# Altium schematic sheet clouds_v302_0.SchDoc: clouds_v302
size 409 x 282 mm; Date: 3/31/2017 1:28:48 PM; SheetNumber: 1
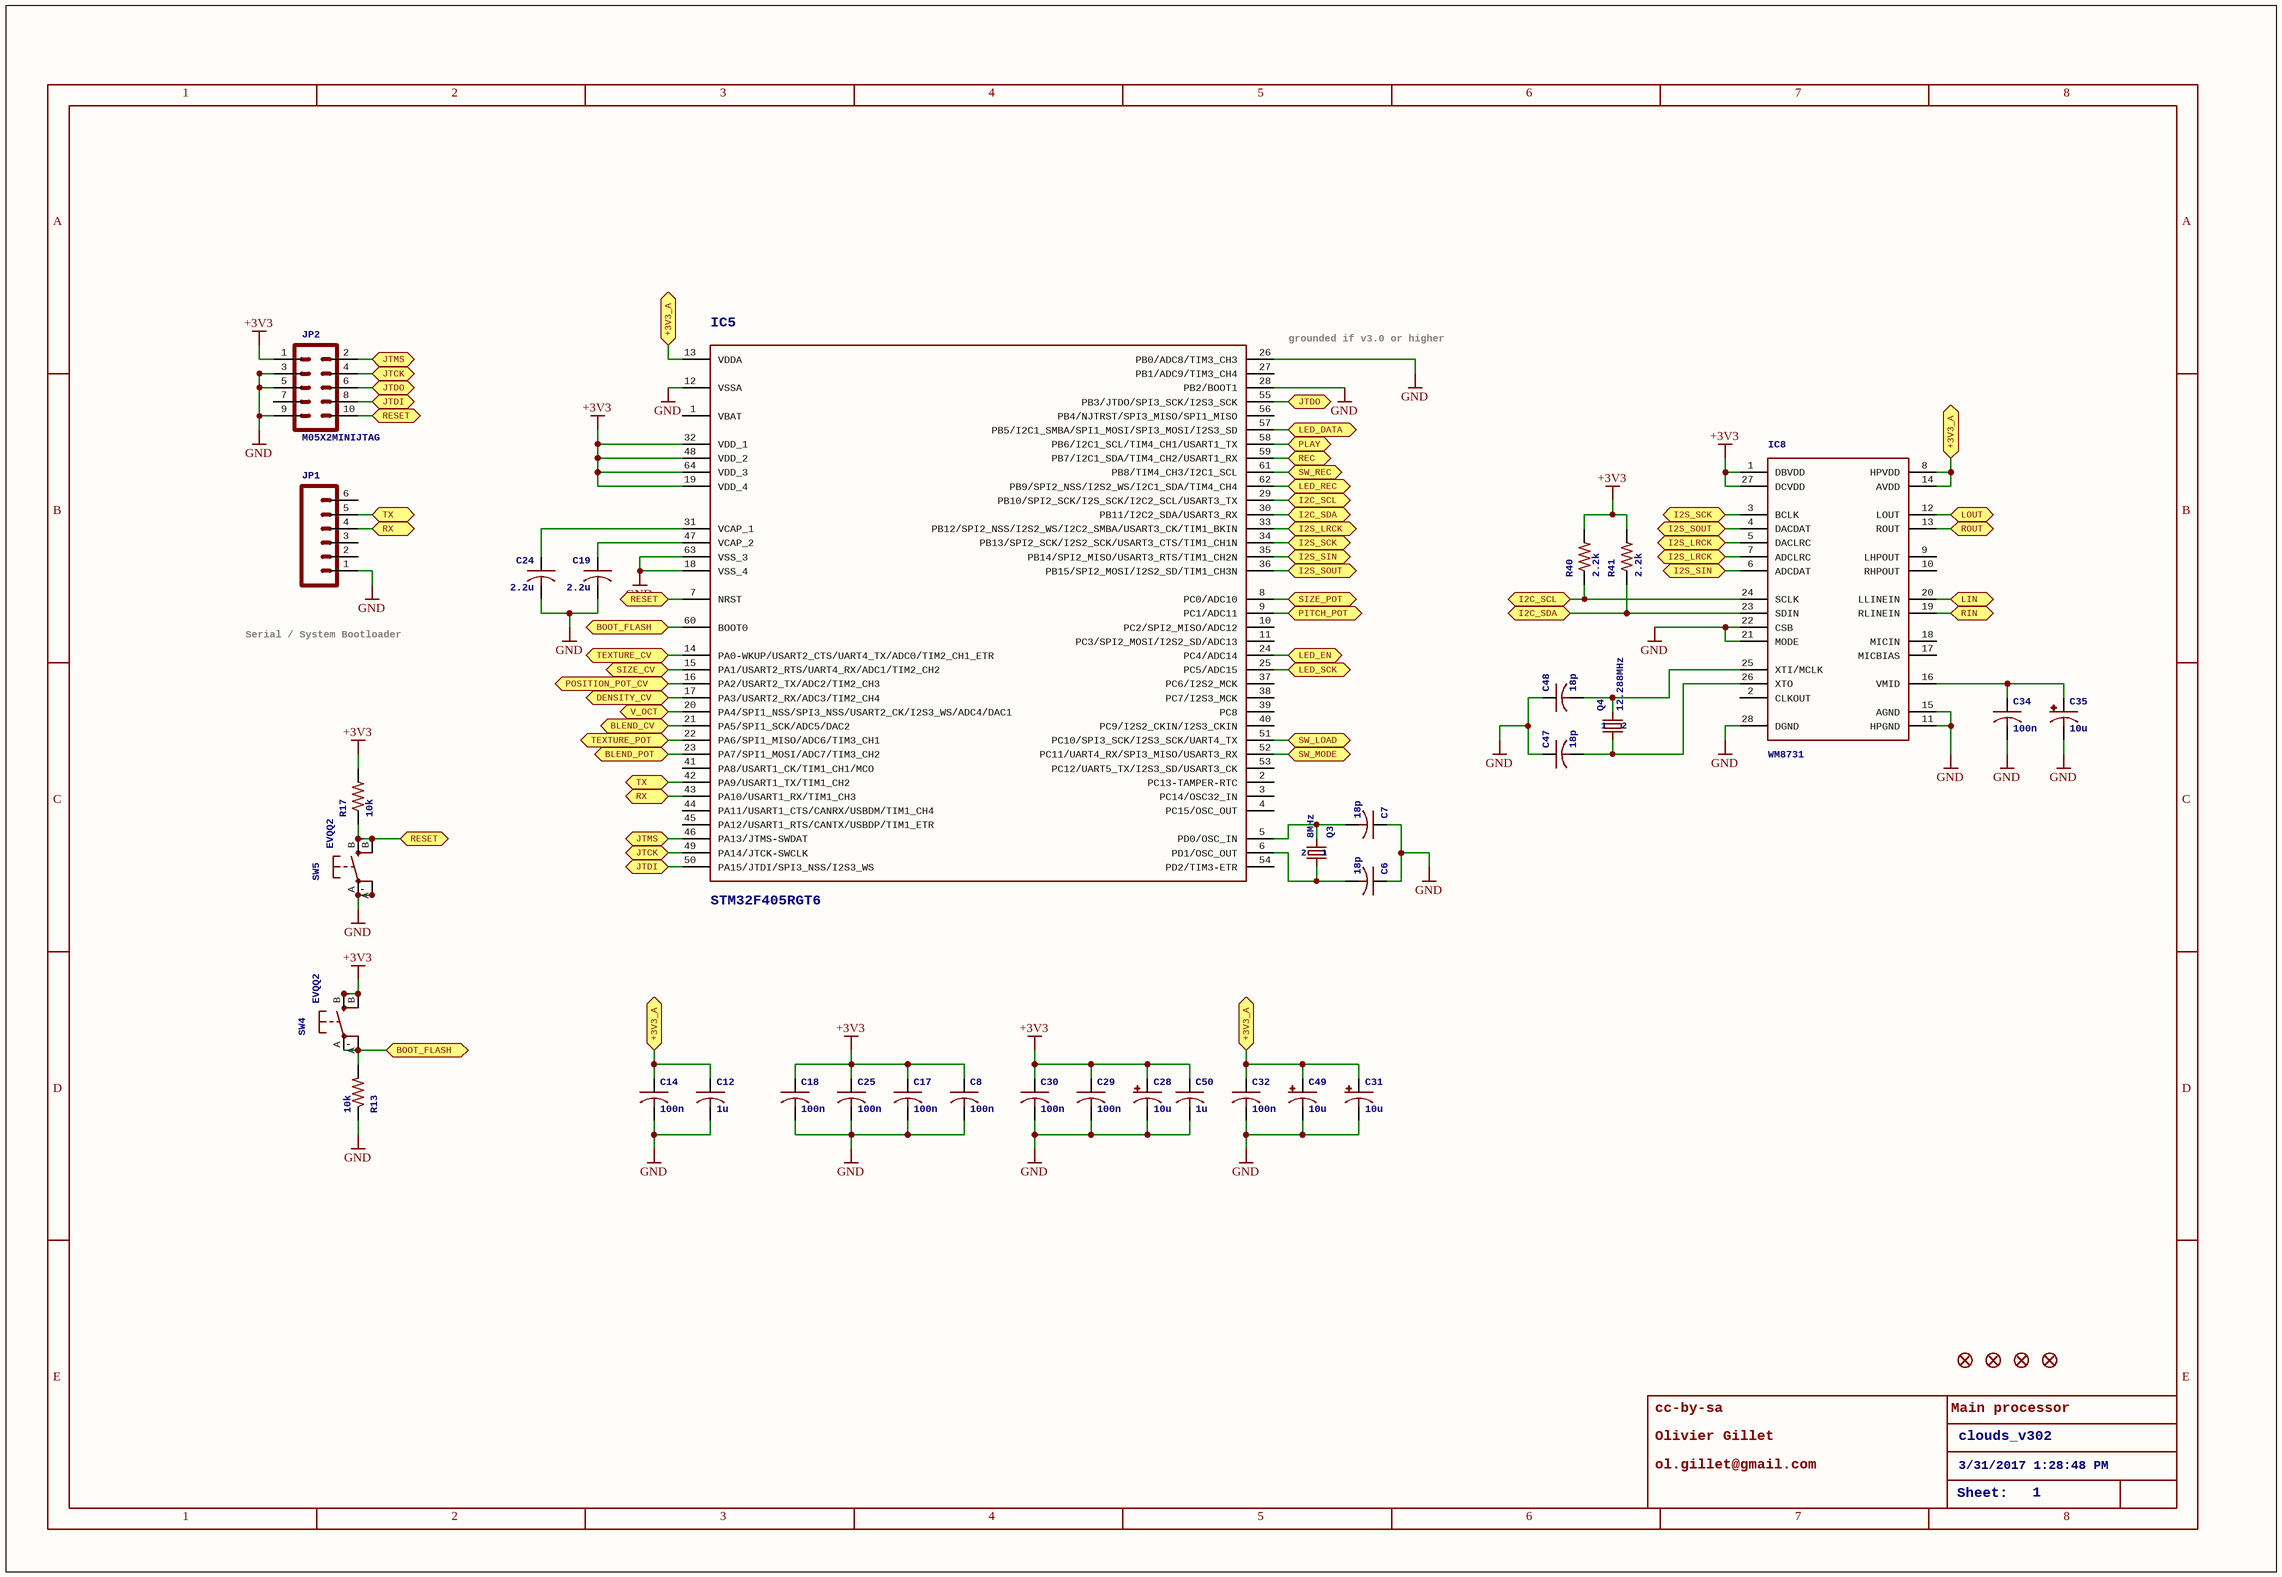
[diagram p0: clouds_v302_0.SchDoc]

## Parts
C6  18p  [C0603]
C7  18p  [C0603]
C8  100n  [C0603]
C12  1u  [C0603]
C14  100n  [C0603]
C17  100n  [C0603]
C18  100n  [C0603]
C19  2.2u  [C0805]
C24  2.2u  [C0805]
C25  100n  [C0603]
C28  10u  [PANASONIC_A]
C29  100n  [C0603]
C30  100n  [C0603]
C31  10u  [PANASONIC_B]
C32  100n  [C0603]
C34  100n  [C0603]
C35  10u  [PANASONIC_B]
C47  18p  [C0603]
C48  18p  [C0603]
C49  10u  [PANASONIC_A]
C50  1u  [C0603]
F1  FIDUCIAL1X2  [FIDUCIAL-1X2]  (value not drawn)
F2  FIDUCIAL1X2  [FIDUCIAL-1X2]  (value not drawn)
F3  FIDUCIAL1X2  [FIDUCIAL-1X2]  (value not drawn)
F4  FIDUCIAL1X2  [FIDUCIAL-1X2]  (value not drawn)
IC5  STM32F405RGT6  [TQFP-10X10-64]
IC8  WM8731  [SSOP28]
JP1  M06SIP  [1X06]  (value not drawn)
JP2  M05X2MINIJTAG  [2X5-1.27]
Q3  8MHz  [HC49UP]
Q4  12.288MHz  [HC49UP]
R13  10k  [R0603]
R17  10k  [R0603]
R40  2.2k  [R0603]
R41  2.2k  [R0603]
SW4  EVQQ2  [EVQ-Q2]
SW5  EVQQ2  [EVQ-Q2]

## Ports
+3V3_A, BLEND_CV, BLEND_POT, BOOT_FLASH, DENSITY_CV, I2C_SCL, I2C_SDA, I2S_LRCK, I2S_SCK, I2S_SIN, I2S_SOUT, JTCK, JTDI, JTDO, JTMS, LED_DATA, LED_EN, LED_REC, LED_SCK, LIN, LOUT, PITCH_POT, PLAY, POSITION_POT_CV, REC, RESET, RIN, ROUT, RX, SIZE_CV, SIZE_POT, SW_LOAD, SW_MODE, SW_REC, TEXTURE_CV, TEXTURE_POT, TX, V_OCT

## Nets
+3V3: C8.1 C17.1 C18.1 C25.1 C28.+ C29.1 C30.1 C50.1 IC5.19(VDD_4) IC5.32(VDD_1) IC5.48(VDD_2) IC5.64(VDD_3) IC8.1(DBVDD) IC8.27(DCVDD) JP2.1 R17.2 R40.2 R41.2 SW4.B(S) SW4.B'(S1)
GND: C6.1 C7.1 C8.2 C12.2 C14.2 C17.2 C18.2 C19.2 C24.2 C25.2 C28.- C29.2 C30.2 C31.- C32.2 C34.2 C35.- C47.1 C48.1 C49.- C50.2 IC5.12(VSSA) IC5.18(VSS_4) IC5.26(PB0/ADC8/TIM3_CH3) IC5.28(PB2/BOOT1) IC5.63(VSS_3) IC8.11(HPGND) IC8.15(AGND) IC8.21(MODE) IC8.22(CSB) IC8.28(DGND) JP1.1 JP2.3 JP2.5 JP2.9 R13.1 SW5.A(P) SW5.A'(P1)
+3V3_A: C12.1 C14.1 C31.+ C32.1 C49.+ IC5.13(VDDA) IC8.8(HPVDD) IC8.14(AVDD) ; port +3V3_A
BLEND_CV: IC5.21(PA5/SPI1_SCK/ADC5/DAC2) ; port BLEND_CV
BLEND_POT: IC5.23(PA7/SPI1_MOSI/ADC7/TIM3_CH2) ; port BLEND_POT
BOOT_FLASH: IC5.60(BOOT0) R13.2 SW4.A(P) SW4.A'(P1) ; port BOOT_FLASH
DENSITY_CV: IC5.17(PA3/USART2_RX/ADC3/TIM2_CH4) ; port DENSITY_CV
I2C_SCL: IC5.29(PB10/SPI2_SCK/I2S_SCK/I2C2_SCL/USART3_TX) IC8.24(SCLK) R40.1 ; port I2C_SCL
I2C_SDA: IC5.30(PB11/I2C2_SDA/USART3_RX) IC8.23(SDIN) R41.1 ; port I2C_SDA
I2S_LRCK: IC5.33(PB12/SPI2_NSS/I2S2_WS/I2C2_SMBA/USART3_CK/TIM1_BKIN) IC8.5(DACLRC) IC8.7(ADCLRC) ; port I2S_LRCK
I2S_SCK: IC5.34(PB13/SPI2_SCK/I2S2_SCK/USART3_CTS/TIM1_CH1N) IC8.3(BCLK) ; port I2S_SCK
I2S_SIN: IC5.35(PB14/SPI2_MISO/USART3_RTS/TIM1_CH2N) IC8.6(ADCDAT) ; port I2S_SIN
I2S_SOUT: IC5.36(PB15/SPI2_MOSI/I2S2_SD/TIM1_CH3N) IC8.4(DACDAT) ; port I2S_SOUT
JTCK: IC5.49(PA14/JTCK-SWCLK) JP2.4 ; port JTCK
JTDI: IC5.50(PA15/JTDI/SPI3_NSS/I2S3_WS) JP2.8 ; port JTDI
JTDO: IC5.55(PB3/JTDO/SPI3_SCK/I2S3_SCK) JP2.6 ; port JTDO
JTMS: IC5.46(PA13/JTMS-SWDAT) JP2.2 ; port JTMS
LED_DATA: IC5.57(PB5/I2C1_SMBA/SPI1_MOSI/SPI3_MOSI/I2S3_SD) ; port LED_DATA
LED_EN: IC5.24(PC4/ADC14) ; port LED_EN
LED_REC: IC5.62(PB9/SPI2_NSS/I2S2_WS/I2C1_SDA/TIM4_CH4) ; port LED_REC
LED_SCK: IC5.25(PC5/ADC15) ; port LED_SCK
LIN: IC8.20(LLINEIN) ; port LIN
LOUT: IC8.12(LOUT) ; port LOUT
PITCH_POT: IC5.9(PC1/ADC11) ; port PITCH_POT
PLAY: IC5.58(PB6/I2C1_SCL/TIM4_CH1/USART1_TX) ; port PLAY
POSITION_POT_CV: IC5.16(PA2/USART2_TX/ADC2/TIM2_CH3) ; port POSITION_POT_CV
REC: IC5.59(PB7/I2C1_SDA/TIM4_CH2/USART1_RX) ; port REC
RESET: IC5.7(NRST) JP2.10 R17.1 SW5.B(S) SW5.B'(S1) ; port RESET
RIN: IC8.19(RLINEIN) ; port RIN
ROUT: IC8.13(ROUT) ; port ROUT
RX: IC5.43(PA10/USART1_RX/TIM1_CH3) JP1.4 ; port RX
SIZE_CV: IC5.15(PA1/USART2_RTS/UART4_RX/ADC1/TIM2_CH2) ; port SIZE_CV
SIZE_POT: IC5.8(PC0/ADC10) ; port SIZE_POT
SW_LOAD: IC5.51(PC10/SPI3_SCK/I2S3_SCK/UART4_TX) ; port SW_LOAD
SW_MODE: IC5.52(PC11/UART4_RX/SPI3_MISO/USART3_RX) ; port SW_MODE
SW_REC: IC5.61(PB8/TIM4_CH3/I2C1_SCL) ; port SW_REC
TEXTURE_CV: IC5.14(PA0-WKUP/USART2_CTS/UART4_TX/ADC0/TIM2_CH1_ETR) ; port TEXTURE_CV
TEXTURE_POT: IC5.22(PA6/SPI1_MISO/ADC6/TIM3_CH1) ; port TEXTURE_POT
TX: IC5.42(PA9/USART1_TX/TIM1_CH2) JP1.5 ; port TX
V_OCT: IC5.20(PA4/SPI1_NSS/SPI3_NSS/USART2_CK/I2S3_WS/ADC4/DAC1) ; port V_OCT
NetC6_2: C6.2 IC5.6(PD1/OSC_OUT) Q3.1
NetC7_2: C7.2 IC5.5(PD0/OSC_IN) Q3.2
NetC19_1: C19.1 IC5.47(VCAP_2)
NetC24_1: C24.1 IC5.31(VCAP_1)
NetC34_1: C34.1 C35.+ IC8.16(VMID)
NetC47_2: C47.2 IC8.26(XTO) Q4.1
NetC48_2: C48.2 IC8.25(XTI/MCLK) Q4.2

Not connected (* = marked no-connect by the designer): IC5 1(VBAT) 2(PC13-TAMPER-RTC) 3(PC14/OSC32_IN) 4(PC15/OSC_OUT) 10(PC2/SPI2_MISO/ADC12) 11(PC3/SPI2_MOSI/I2S2_SD/ADC13) 27(PB1/ADC9/TIM3_CH4) 37(PC6/I2S2_MCK) 38(PC7/I2S3_MCK) 39(PC8) 40(PC9/I2S2_CKIN/I2S3_CKIN) 41(PA8/USART1_CK/TIM1_CH1/MCO) 44(PA11/USART1_CTS/CANRX/USBDM/TIM1_CH4) 45(PA12/USART1_RTS/CANTX/USBDP/TIM1_ETR) 53(PC12/UART5_TX/I2S3_SD/USART3_CK) 54(PD2/TIM3-ETR) 56(PB4/NJTRST/SPI3_MISO/SPI1_MISO); IC8 2(CLKOUT) 9(LHPOUT) 10(RHPOUT) 17(MICBIAS) 18(MICIN); JP1 2 3 6; JP2 7

## Notes on the sheet
- (near IC5) grounded if v3.0 or higher
- Serial / System Bootloader
- cc-by-sa
- Olivier Gillet
- Main processor
- clouds_v302
- ol.gillet@gmail.com
- Sheet:
- 3/31/2017 1:28:48 PM
- 1
- 2
- 3
- 4
- 5
- 6
- 7
- 8
- A
- B
- C
- D
- E

## Library data of the parts
C6-C8 C12 C14 C17 C18 C25 C29 C30 C32 C34 C47 C48 C50 = C-USC0603: CAPACITOR, American symbol
C19 C24 = C-USC0805: CAPACITOR, American symbol
C28 C49 = CPOL-USA: POLARIZED CAPACITOR, American symbol
C31 C35 = CPOL-USB: POLARIZED CAPACITOR, American symbol
F1-F4 = FIDUCIAL1X2: Fiducial Alignment PointsVarious fiducial points for machine vision alignment.
IC5 = STM32F20X
JP1 = M06SIP: Header 6Standard 6-pin 0.1" header. Use with straight break away headers (SKU : PRT-00116), right angle break away headers (PRT-00553), swiss pins (PRT-00743), machine pins (PRT-00117), and female headers (PRT-00115). Molex polarized connector foot print use with SKU : PRT-08094 with associated crimp pins and housings. NOTES ON THE VARIANTS LOCK and LOCK_LONGPADS... This footprint was designed to help hold the alignment of a through-hole component (i.e.  6-pin header) while soldering it into place. You may notice that each hole has been shifted either up or down by 0.005 of an inch from it's more standard position (which is a perfectly straight line). This slight alteration caused the pins (the squares in the middle) to touch the edges of the holes.  Because they are alternating, it causes a "brace" to hold the component in place.  0.005 has proven to be the perfect amount of "off-center" position when using our standard breakaway headers. Although looks a little odd when you look at the bare footprint, once you have a header in there, the alteration is very hard to notice.  Also, if you push a header all the way into place, it is covered up entirely on the bottom side.  This idea of altering the position of holes to aid alignment will be further integrated into the Sparkfun Library for other footprints.  It can help hold any component with 3 or more connection pins.
JP2 = M05X2MINIJTAG: Header 5x2Standard 10-pin dual row 0.1" header. Commonly used with AVR-ISP. Use with Spark Fun Electronics SKU: PRT-00778
Q3 Q4 = CRYSTALHC49UP: CRYSTAL; 1: 1; 2: 2
R13 R17 R40 R41 = R-US_R0603: RESISTOR, American symbol
SW4 SW5 = EVQQ2: SMT 6mm switch, EVQQ2 series    http://www.ladyada.net/library/eagle
IC8 = WM8731: WM8731: WM8731